# EAGLE design SendSlice (EAGLE 7.5.0)
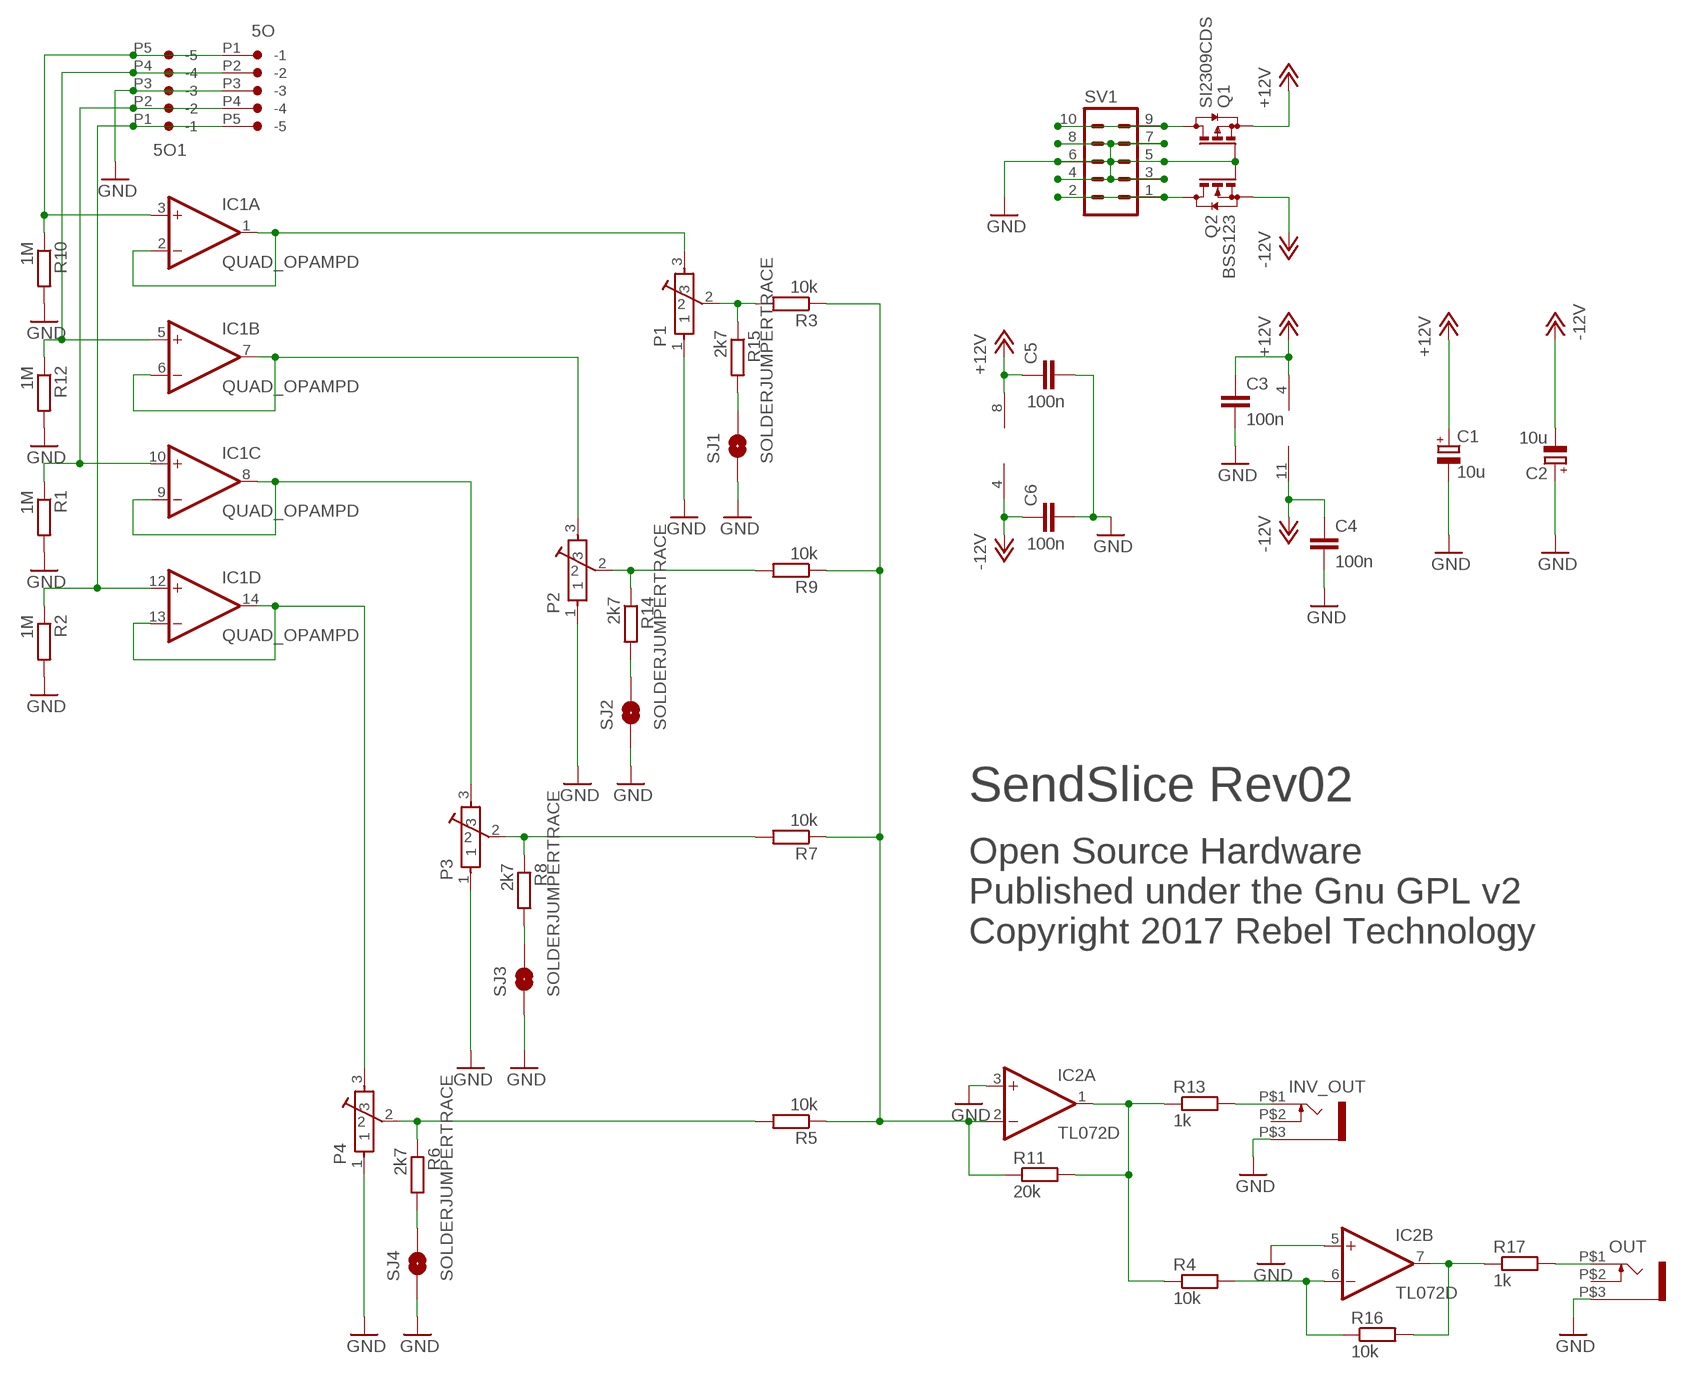
[diagram p0: schematic, sheet 1]

## Parts
5O  CON-JST_PH_5W  [CON-JST_PH_5W]
5O1  CON-JST_PH_5W  [CON-JST_PH_5W]
C1  10u  CPOL-EU153CLV-0505  [153CLV-0505]
C2  10u  CPOL-EU153CLV-0505  [153CLV-0505]
C3  100n  C-EUC0603  [C0603]
C4  100n  C-EUC0603  [C0603]
C5  100n  C-EUC0603  [C0603]
C6  100n  C-EUC0603  [C0603]
IC1  QUAD_OPAMPD  [SO14]
IC2  TL072D  [SO08]
INV_OUT  JACK-UJ-3502-R  [UJ-3502-R]
OUT  JACK-UJ-3502-R  [UJ-3502-R]
P1  10k lin  POT-BOURNS-PTD901  [POT-BOURNS-PTD901]
P2  10k lin  POT-BOURNS-PTD901  [POT-BOURNS-PTD901]
P3  10k lin  POT-BOURNS-PTD901  [POT-BOURNS-PTD901]
P4  10k lin  POT-BOURNS-PTD901  [POT-BOURNS-PTD901]
Q1  SI2309CDS  BSS84  [SOT23]
Q2  BSS123  [SOT23]
R1  1M  R-EU_0603  [0603]
R2  1M  R-EU_0603  [0603]
R3  10k  R-EU_0603  [0603]
R4  10k  R-EU_0603  [0603]
R5  10k  R-EU_0603  [0603]
R6  2k7  R-EU_0603  [0603]
R7  10k  R-EU_0603  [0603]
R8  2k7  R-EU_0603  [0603]
R9  10k  R-EU_0603  [0603]
R10  1M  R-EU_0603  [0603]
R11  20k  R-EU_0603  [0603]
R12  1M  R-EU_0603  [0603]
R13  1k  R-EU_0603  [0603]
R14  2k7  R-EU_0603  [0603]
R15  2k7  R-EU_0603  [0603]
R16  10k  R-EU_0603  [0603]
R17  1k  R-EU_0603  [0603]
SJ1  SOLDERJUMPERTRACE  [SJ_2S-TRACE]
SJ2  SOLDERJUMPERTRACE  [SJ_2S-TRACE]
SJ3  SOLDERJUMPERTRACE  [SJ_2S-TRACE]
SJ4  SOLDERJUMPERTRACE  [SJ_2S-TRACE]
SV1  MA05-2  [MA05-2]

## Nets
+12V: C1.+ C3.1 C5.1 IC1.4(P:V+) IC2.8(P:V+) Q1.2(S)
-12V: C2.- C4.1 C6.1 IC1.11(P:V-) IC2.4(P:V-) Q2.2(S)
GND: 5O1.P3(-3) 5O.P3(-3) C1.- C2.+ C3.2 C4.2 C5.2 C6.2 IC2.3(A:+IN) IC2.5(B:+IN) INV_OUT.P$3(SLEEVE) OUT.P$3(SLEEVE) P1.1 P2.1 P3.1 P4.1 Q1.1(G) Q2.1(G) R1.2 R2.2 R10.2 R12.2 SJ1.1 SJ2.1 SJ3.1 SJ4.1 SV1.3 SV1.4 SV1.5 SV1.6 SV1.7 SV1.8
IN_1: 5O1.P5(-5) 5O.P1(-1) IC1.3(A:+IN) R10.1
IN_2: 5O1.P4(-4) 5O.P2(-2) IC1.5(B:+IN) R12.1
IN_3: 5O1.P2(-2) 5O.P4(-4) IC1.10(C:+IN) R1.1
IN_4: 5O1.P1(-1) 5O.P5(-5) IC1.12(D:+IN) R2.1
N$1: Q2.3(D) SV1.1 SV1.2
N$2: P2.2 R9.2 R14.1
N$3: P1.2 R3.2 R15.1
N$4: IC1.6(B:-IN) IC1.7(B:OUT) P2.3
N$5: IC1.1(A:OUT) IC1.2(A:-IN) P1.3
N$6: IC2.1(A:OUT) R4.1 R11.2 R13.1
N$7: IC2.7(B:OUT) R16.2 R17.1
N$8: IC2.2(A:-IN) R3.1 R5.1 R7.1 R9.1 R11.1
N$9: INV_OUT.P$1(TIP) R13.2
N$10: R15.2 SJ1.2
N$11: IC1.13(D:-IN) IC1.14(D:OUT) P4.3
N$12: R6.2 SJ4.2
N$13: IC1.8(C:OUT) IC1.9(C:-IN) P3.3
N$14: Q1.3(D) SV1.9 SV1.10
N$15: R8.2 SJ3.2
N$16: R14.2 SJ2.2
N$17: IC2.6(B:-IN) R4.2 R16.1
N$18: OUT.P$1(TIP) R17.2
N$29: P4.2 R5.2 R6.1
N$51: P3.2 R7.2 R8.1
Unconnected: INV_OUT.P$2(SW) OUT.P$2(SW)

## Notes on the sheet
- SendSlice Rev02
- Open Source Hardware
  Published under the Gnu GPL v2
  Copyright 2017 Rebel Technology

## Library data of the parts
5O 5O1 = Rebel:CON-JST_PH_5W
C1 C2 = rcl:CPOL-EU: POLARIZED CAPACITOR, European symbol
C3-C6 = Rebel:C-EU: CAPACITOR, European symbol
IC1 = adafruit:QUAD_OPAMP: OP AMP Standard quad package
IC2 = linear:TL072: OP AMP
INV_OUT OUT = Rebel:JACK-UJ-3502-R
P1-P4 = Rebel:POT-BOURNS-PTD901
Q1 = transistor-small-signal:BSS84: P-CHANNEL MOS FET
Q2 = transistor-small-signal:BSS123: N-CHANNEL MOS FET
R1-R17 = Rebel:R-EU_: RESISTOR, European symbol
SJ1-SJ4 = SparkFun:SOLDERJUMPER: Solder Jumper Standard SMD solder jumper. Used to automate production. Two varients : Normally Open and Normally Closed are the same, but have different paste layers. NC will have a large amount of paste and should jumper during reflow.
SV1 = con-lstb:MA05-2: PIN HEADER; OC_FARNELL: unknown; OC_NEWARK: unknown

## Board
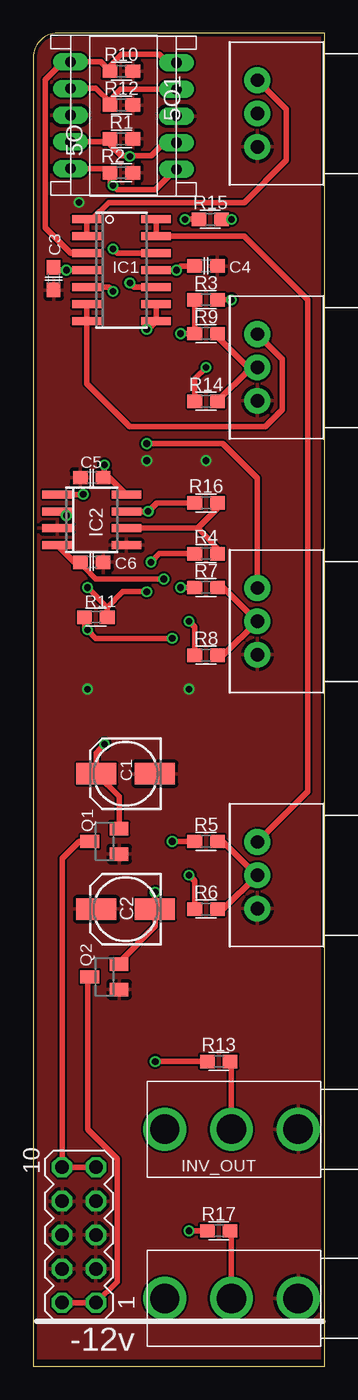
[diagram p1: board, top side]
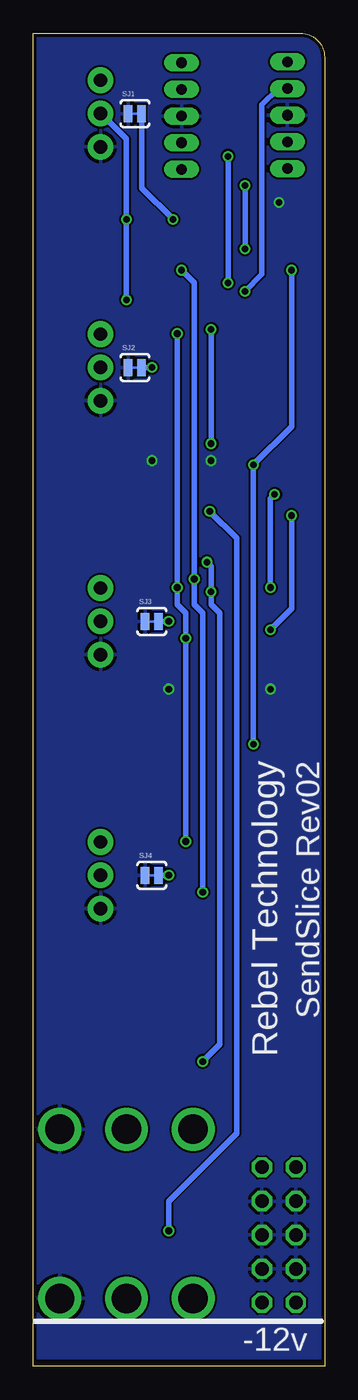
[diagram p2: board, bottom side, seen from below]

Size 21.84 x 100 mm. Coordinates in mm from the lower left corner, seen from the top.
Outline: 21.84,0 21.84,100 1.79,100 arc90 0,98.21 0,0 21.84,0
Copper layers (1*16): Top 0.035mm / dielectric 1.5mm / Bottom 0.035mm
Design rules "SeeedStudio_2layer_DRU_no_angle_20140221": minimum track width 6mil, minimum drill 12mil, track to track 6mil, track to pad 6mil, pad to pad 6mil, via to via 6mil, smd to smd 0mil, copper to edge 10mil, drill to drill 10mil, minimum pad ring 10mil, minimum via ring 6mil, stop-mask expansion 2mil, vias tented up to drill 100mil, thermal gap 10mil

### Footprints (pad centres in the part's own frame; a part is rotated, then mirrored left to right if it is on the bottom)
CON-JST_PH_5W = drill 0.8 long: P1 0,0; P2 -2,0; P3 -4,0; P4 -6,0; P5 -8,0
153CLV-0505 = smd 3 x 1.6: + 2.2,0; - -2.2,0
C0603 = smd 1.1 x 1: 1 -0.85,0; 2 0.85,0
SO14 = smd 0.6 x 2.2: 1 -3.81,-2.6; 2 -2.54,-2.6; 3 -1.27,-2.6; 4 0,-2.6; 5 1.27,-2.6; 6 2.54,-2.6; 7 3.81,-2.6; 8 3.81,2.6; 9 2.54,2.6; 10 1.27,2.6; 11 0,2.6; 12 -1.27,2.6; 13 -2.54,2.6; 14 -3.81,2.6
SO08 = smd 0.6 x 2.2: 1 -1.905,-2.6; 2 -0.635,-2.6; 3 0.635,-2.6; 4 1.905,-2.6; 5 1.905,2.6; 6 0.635,2.6; 7 -0.635,2.6; 8 -1.905,2.6
UJ-3502-R = drill 2.2: P$1 0,0; P$2 0,5; P$3 0,-5
POT-BOURNS-PTD901 = drill 1 pad 1.93: 1 -2.5,-0.036; 2 0,-0.036; 3 2.5,-0.036
SOT23 = smd 1 x 1.4: 1 -0.95,-1.1; 2 0.95,-1.1; 3 0,1.1
0603 = smd 1.1 x 1: 1 -0.85,0; 2 0.85,0
SJ_2S-TRACE = smd 0.635 x 1.27: 1 -0.508,0; 2 0.508,0
MA05-2 = drill 1.016 octagon: 1 -5.08,-1.27; 2 -5.08,1.27; 3 -2.54,-1.27; 4 -2.54,1.27; 5 0,-1.27; 6 0,1.27; 7 2.54,-1.27; 8 2.54,1.27; 9 5.08,-1.27; 10 5.08,1.27

### Placement (x,y rotation side)
5O  10.73,97.79 90 top
5O1  2.79,89.85 270 top
C1  6.92,44.45 180 top
C2  6.92,34.29 180 top
C3  1.52,81.6 270 top
C4  12.95,82.55 0 top
C5  4.38,66.67 180 top
C6  4.38,60.33 0 top
IC1  6.6,82.23 270 top
IC2  4.38,63.5 270 top
INV_OUT  14.86,17.78 90 top
OUT  14.86,5.08 90 top
P1  16.76,93.98 90 top
P2  16.76,74.93 90 top
P3  16.76,55.88 90 top
P4  16.76,36.83 90 top
Q1  5.33,39.37 90 top
Q2  5.33,29.21 90 top
R1  6.6,92.08 0 top
R2  6.6,89.53 0 top
R3  12.95,80.01 0 top
R4  12.95,60.96 0 top
R5  12.95,39.37 0 top
R6  12.95,34.29 180 top
R7  12.95,58.42 0 top
R8  12.95,53.34 180 top
R9  12.95,77.47 0 top
R10  6.6,97.16 0 top
R11  4.7,56.2 0 top
R12  6.6,94.61 0 top
R13  13.91,22.86 0 top
R14  12.95,72.39 180 top
R15  13.27,86.04 180 top
R16  12.95,64.77 180 top
R17  13.91,10.16 0 top
SJ1  14.22,93.98 0 bottom
SJ2  14.22,74.93 0 bottom
SJ3  12.95,55.88 0 bottom
SJ4  12.95,36.83 0 bottom
SV1  3.43,9.84 90 top

### Tracks (layer width: path | path; a pad name or v marks a point on that pad's centre or on a via)
+12V  (via drill 0.5)
  Top 0.406: Q1.2 6.43,42.74 C1.+ 4.72,46.02 v5.33,46.67 | IC1.4 v2.48,82.23 1.74,82.23 C3.1 | IC2.8 5.71,66.67 C5.1 5.33,66.78 v5.33,67.63
  Bottom 0.406: v5.33,46.67 v5.33,67.63 2.48,70.48 v2.48,82.23
-12V  (via drill 0.5)
  Top 0.406: Q2.2 6.43,30.31 9.14,33.02 9.14,34.27 C2.- 9.12,35.54 v9.14,35.56 | 1.31,61.59 IC2.4 3.05,60.33 C6.1 3.85,60.01 3.85,59.91 4.7,59.05 v9.78,59.05 | C4.1 11.05,82.55 v10.73,82.23 IC1.11
  Bottom 0.406: v9.14,35.56 9.14,56.52 9.78,57.15 v9.78,59.05 9.78,81.28 v10.73,82.23
GND  (via drill 0.5)
  other vias: 4.06,50.8 11.68,50.8 12.95,67.94 8.51,67.94 3.43,87.31
  pour Bottom: -14.99,0.64 29.46,0.64 29.46,100.97 -14.99,100.97
  pour Top: -13.72,0.64 30.73,0.64 30.73,100.97 -13.72,100.97
IN_1
  Top 0.406: IC1.3 2.79,83.5 0.89,85.41 0.89,96.52 2.16,97.79 2.73,97.79 5O1.P5 5.06,97.85 R10.1 5.75,97.58 6.6,98.42 9.46,98.42 10.1,97.79 5O.P1
IN_2  (via drill 0.5)
  Top 0.406: IC1.5 5.65,80.96 v5.97,80.64 | 5O.P2 6.51,95.79 5.75,95.03 R12.1 5.75,94.83 4.7,95.89 2.83,95.89 5O1.P4
  Bottom 0.406: v5.97,80.64 4.7,81.92 4.7,94.65 3.49,95.85 5O1.P4
IN_3  (via drill 0.5)
  Top 0.406: IC1.10 7.56,80.96 v7.24,81.28 | 5O1.P2 5.53,91.85 R1.1 5.75,91.66 6.6,90.81 7.21,90.81 v7.24,90.77 7.27,90.81 8.83,90.81 9.81,91.79 5O.P4
  Bottom 0.406: v7.24,81.28 v7.24,90.77
IN_4  (via drill 0.5)
  Top 0.406: IC1.12 6.29,83.5 v5.97,83.82 | 5O.P5 10.67,89.79 9.14,88.27 6.29,88.27 v5.97,88.58 5.75,88.8 R2.1 5.44,89.85 5O1.P1
  Bottom 0.406: v5.97,83.82 v5.97,88.58
N$1
  Top 0.406: SV1.2 SV1.1 6.29,6.35 6.29,15.56 4.06,17.78 4.06,29.04 Q2.3
N$2
  Top 0.406: P2.2 16.34,74.93 16.24,74.82 | 16.24,74.82 R14.1 | R9.2 13.8,77.25 16.24,74.82
N$3  (via drill 0.5)
  Top 0.406: v14.86,80.01 R3.2 | R15.1 v14.86,86.04
  Bottom 0.406: P1.2 16.76,93.98 14.86,92.08 v14.86,86.04 v14.86,80.01
N$4
  Top 0.406: P2.3 18.67,75.56 18.67,71.75 17.4,70.48 7.24,70.48 4,73.72 IC1.7 IC1.6
N$5
  Top 0.406: IC1.2 IC1.1 4.38,86.04 5.65,87.31 15.81,87.31 18.99,90.49 18.99,94.29 P1.3
N$6  (via drill 0.5)
  Top 0.406: R4.1 9.46,60.96 v8.83,60.33 | v9.14,22.86 R13.1 | IC2.1 v3.75,65.41 | R11.2 5.55,56.94 | 5.55,56.94 v4.06,58.42 | v8.51,58.1 6.72,58.1 5.55,56.94
  Bottom 0.406: v8.83,60.33 8.51,60.01 v8.51,58.1 8.51,57.15 7.87,56.52 7.87,24.13 v9.14,22.86 | v3.75,65.41 4.06,65.09 v4.06,58.42
N$7  (via drill 0.5)
  Top 0.406: IC2.7 v8.61,64.14 9.25,64.77 R16.2 | R17.1 v11.68,10.16
  Bottom 0.406: v11.68,10.16 11.68,12.38 6.6,17.46 6.6,62.13 v8.61,64.14
N$8  (via drill 0.5)
  Top 0.406: v10.41,39.37 R5.1 | R7.1 v11.05,58.42 | v11.05,77.47 R9.1 R3.1 | R11.1 3.85,55.46 v4.06,55.24 4.7,54.61 v10.41,54.61 | IC2.2 2.16,64.14 v2.48,63.82
  Bottom 0.406: v11.05,77.47 v11.05,58.42 11.05,57.15 10.41,56.52 v10.41,54.61 v10.41,39.37 | v2.48,63.82 2.48,56.83 v4.06,55.24
N$9
  Top 0.406: INV_OUT.P$1 14.86,22.76 R13.2
N$10  (via drill 0.5)
  Top 0.406: v11.37,86.04 R15.2
  Bottom 0.406: v11.37,86.04 13.72,88.39 SJ1.2
N$11
  Top 0.406: IC1.14 IC1.13 15.81,84.77 20.57,80.01 20.57,43.1 P4.3
N$12  (via drill 0.5)
  Top 0.406: R6.2 12.1,36.41 v11.68,36.83
  Bottom 0.406: v11.68,36.83 SJ4.2
N$13  (via drill 0.5)
  Top 0.406: P3.3 16.8,66.64 14.22,69.22 v8.51,69.22 | IC1.9 IC1.8 8.57,77.79 v8.51,77.79
  Bottom 0.406: v8.51,69.22 v8.51,77.79
N$14
  Top 0.406: SV1.9 SV1.10 2.16,38.1 3.43,39.37 Q1.3
N$15  (via drill 0.5)
  Top 0.406: R8.2 12.1,55.46 v11.68,55.88
  Bottom 0.406: v11.68,55.88 SJ3.2
N$16  (via drill 0.5)
  Top 0.406: R14.2 12.1,74.08 v12.95,74.93
  Bottom 0.406: v12.95,74.93 SJ2.2
N$17
  Top 0.406: IC2.6 12.32,62.87 | R16.1 13.8,64.35 12.32,62.87 | R4.2 13.8,61.38 12.32,62.87
N$18
  Top 0.406: OUT.P$1 14.86,10.06 R17.2
N$29
  Top 0.406: R6.1 14.26,34.29 P4.2 16.76,36.83 14.22,39.37 R5.2
N$51
  Top 0.406: R8.1 14.26,53.34 P3.2 14.26,58.42 R7.2

### Text on the board
tPlace: -12v
bPlace: SendSlice Rev02 | Rebel Technology | -12v